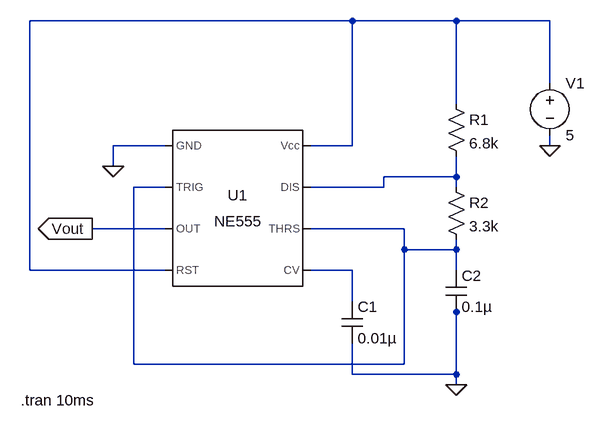
[diagram p0: schematic exp_9_electro.asc]
exp_9_electro.asc, the LTspice schematic file:
Version 4
SHEET 1 880 680
WIRE 432 -96 -64 -96
WIRE 592 -96 432 -96
WIRE 736 -96 592 -96
WIRE 736 0 736 -96
WIRE 592 32 592 -96
WIRE 144 96 64 96
WIRE 432 96 432 -96
WIRE 432 96 368 96
WIRE 736 96 736 80
WIRE 64 128 64 96
WIRE 592 144 592 112
WIRE 592 144 480 144
WIRE 144 160 96 160
WIRE 480 160 480 144
WIRE 480 160 368 160
WIRE 592 160 592 144
WIRE 144 224 32 224
WIRE 512 224 368 224
WIRE 512 256 512 224
WIRE 592 256 592 240
WIRE 592 256 512 256
WIRE -64 288 -64 -96
WIRE 144 288 -64 288
WIRE 432 288 368 288
WIRE 592 288 592 256
WIRE 432 336 432 288
WIRE 592 352 592 336
WIRE 96 432 96 160
WIRE 512 432 512 256
WIRE 512 432 96 432
WIRE 432 448 432 400
WIRE 592 448 592 352
WIRE 592 448 432 448
WIRE 592 464 592 448
FLAG 64 128 0
FLAG 736 96 0
FLAG 592 464 0
FLAG 32 224 Vout
IOPIN 32 224 Out
SYMBOL Misc\\NE555 256 192 R0
SYMATTR InstName U1
SYMBOL voltage 736 -16 R0
WINDOW 123 0 0 Left 0
WINDOW 39 0 0 Left 0
SYMATTR InstName V1
SYMATTR Value 5
SYMBOL res 576 16 R0
SYMATTR InstName R1
SYMATTR Value 6.8k
SYMBOL res 576 144 R0
SYMATTR InstName R2
SYMATTR Value 3.3k
SYMBOL cap 416 336 R0
SYMATTR InstName C1
SYMATTR Value 0.01µ
SYMBOL cap 576 288 R0
SYMATTR InstName C2
SYMATTR Value 0.1µ
TEXT -78 488 Left 2 !.tran 10ms

The netlist it stands for:
* exp_9_electro.asc
XU1 0 N003 Vout N001 N004 N003 N002 N001 NE555  ; pins GND TRIG OUT RST CV THRS DIS Vcc
V1 N001 0 5
R1 N001 N002 6.8k
R2 N002 N003 3.3k
C1 N004 0 0.01µ
C2 N003 0 0.1µ
.tran 10ms
.lib NE555.sub
.backanno
.end